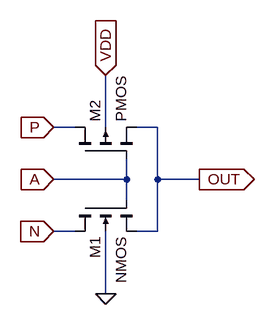
[diagram p0: schematic GDICell.asc]
GDICell.asc, the LTspice schematic file:
Version 4
SHEET 1 880 680
WIRE 176 96 144 96
WIRE 224 96 224 16
WIRE 304 96 272 96
WIRE 256 176 256 144
WIRE 256 176 144 176
WIRE 304 176 304 96
WIRE 368 176 304 176
WIRE 256 208 256 176
WIRE 176 256 144 256
WIRE 304 256 304 176
WIRE 304 256 272 256
WIRE 224 352 224 256
FLAG 144 96 P
IOPIN 144 96 In
FLAG 144 256 N
IOPIN 144 256 In
FLAG 144 176 A
IOPIN 144 176 In
FLAG 368 176 OUT
IOPIN 368 176 Out
FLAG 224 16 VDD
IOPIN 224 16 In
FLAG 224 352 0
SYMBOL nmos4 176 208 M90
SYMATTR InstName M1
SYMATTR Value2 l=65nm w=65nm
SYMBOL pmos4 176 144 R270
SYMATTR InstName M2
SYMATTR Value2 l=162.5nm w=65nm

The netlist it stands for:
* GDICell.asc
M1 N A OUT 0 NMOS l=65nm w=65nm
M2 P A OUT VDD PMOS l=162.5nm w=65nm
.model NMOS NMOS
.model PMOS PMOS
.lib standard.mos
.backanno
.end